# EAGLE design Esp8266_DevBoard (EAGLE 6.5.0)
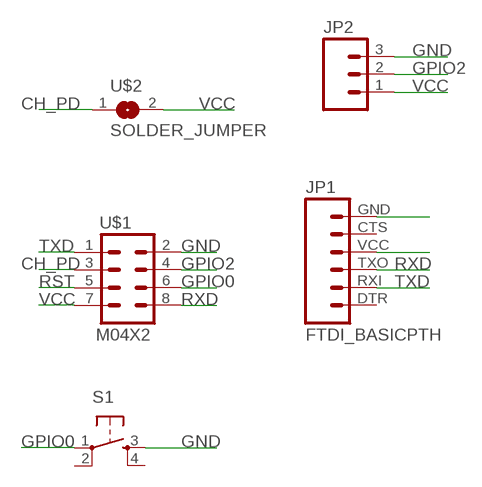
[diagram p0: schematic, sheet 1]

## Parts
JP1  FTDI_BASICPTH  [FTDI_BASIC]
JP2  M03PTH  [1X03]
S1  6MM_SWITCH6MM_SWITCH  [6MM_SWITCH]
U$1  M04X2  [2X4]
U$2  SOLDER_JUMPER  [SJFAB]

## Nets
CH_PD: U$1.3 U$2.1
GND: JP1.GND JP2.3 S1.3(S) U$1.2
GPIO0: S1.1(P) U$1.6
GPIO2: JP2.2 U$1.4
RST: U$1.5
RXD: JP1.TXO U$1.8
TXD: JP1.RXI U$1.1
VCC: JP1.VCC JP2.1 U$1.7 U$2.2
Unconnected: JP1.CTS JP1.DTR S1.2(P1) S1.4(S1)

## Library data of the parts
JP1 = SparkFun-Connectors:FTDI_BASIC: FTDI Basic header with labels
JP2 = SparkFun-Connectors:M03: Header 3 Standard 3-pin 0.1" header. Use with straight break away headers (SKU : PRT-00116), right angle break away headers (PRT-00553), swiss pins (PRT-00743), machine pins (PRT-00117), and female headers (PRT-00115). Molex polarized connector foot print use with SKU : PRT-08232 with associated crimp pins and housings.
S1 = fab:6MM_SWITCH: OMRON SWITCH
U$1 = SparkFun-Connectors:M04X2: .1" header, two rows of four.
U$2 = fab:SOLDER_JUMPER

## Board
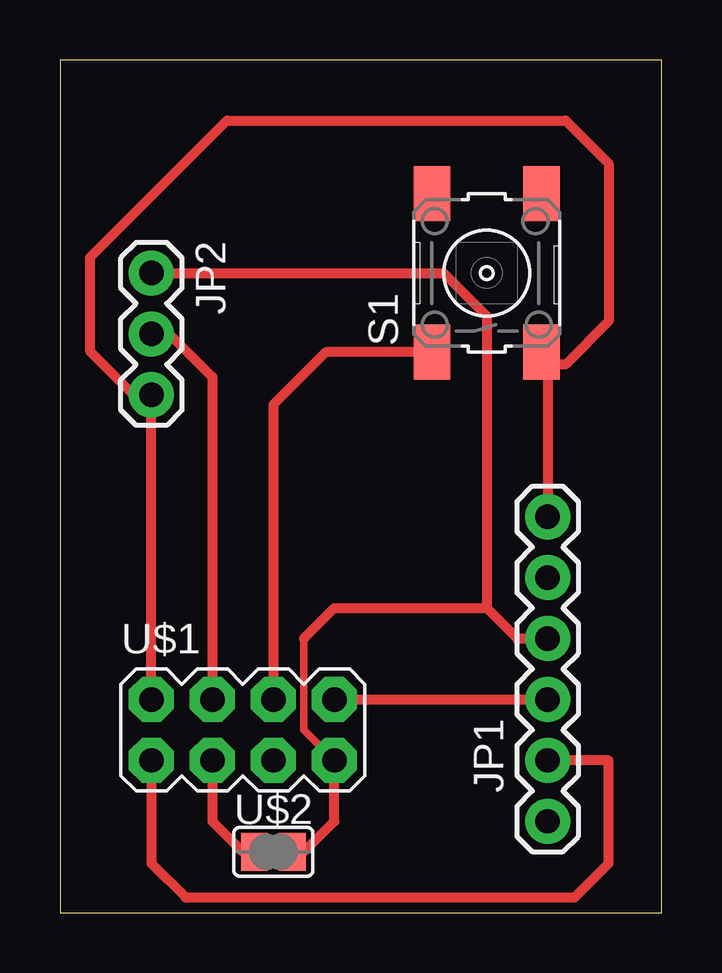
[diagram p1: board, top side]

Size 25.07 x 35.55 mm. Coordinates in mm from the lower left corner, seen from the top.
Outline: 0,0 25.07,0 25.07,35.55 0,35.55 0,0
Copper layers (1*16): Top 0.035mm / dielectric 1.5mm / Bottom 0.035mm
Design rules "default": minimum track width 10mil, minimum drill 24mil, track to track 8mil, track to pad 8mil, pad to pad 8mil, via to via 8mil, smd to smd 8mil, copper to edge 40mil, drill to drill 8mil, minimum pad ring 10mil, minimum via ring 8mil, stop-mask expansion 4mil, vias tented up to drill 0mil, thermal gap 10mil

### Footprints (pad centres in the part's own frame; a part is rotated, then mirrored left to right if it is on the bottom)
FTDI_BASIC = drill 1.016 pad 1.88: CTS 10.16,0; DTR 0,0; GND 12.7,0; RXI 2.54,0; TXO 5.08,0; VCC 7.62,0
1X03 = drill 1.016 pad 1.88: 1 0,0; 2 2.54,0; 3 5.08,0
6MM_SWITCH = smd 2.286 x 1.524: 1 -3.302,2.286; 2 3.302,2.286; 3 -3.302,-2.286; 4 3.302,-2.286
2X4 = drill 1.016 pad 1.88 octagon: 1 -3.81,-1.27; 2 -3.81,1.27; 3 -1.27,-1.27; 4 -1.27,1.27; 5 1.27,-1.27; 6 1.27,1.27; 7 3.81,-1.27; 8 3.81,1.27
SJFAB = smd 1.118 x 1.6: 1 -0.787,0; 2 0.787,0

### Placement (x,y rotation side)
JP1  20.32,3.81 90 top
JP2  3.81,26.67 270 top
S1  17.78,26.67 90 top
U$1  7.62,7.62 0 top
U$2  8.89,2.54 0 top

### Tracks (layer width: path | path; a pad name or v marks a point on that pad's centre or on a via)
CH_PD
  Top 0.406: U$1.3 6.35,3.81 7.62,2.54 U$2.1
GND
  Top 0.406: S1.3 20.32,23.37 20.32,22.86 | 20.32,22.86 JP1.GND | U$1.2 JP2.3 3.07,21.59 1.27,23.39 1.27,27.34 6.95,33.02 21.06,33.02 22.86,31.22 22.86,24.66 21.06,22.86 20.32,22.86
GPIO0
  Top 0.406: S1.1 11.07,23.37 8.89,21.18 U$1.6
GPIO2
  Top 0.406: JP2.2 4.55,24.13 6.35,22.33 U$1.4
RXD
  Top 0.406: U$1.8 JP1.TXO
TXD
  Top 0.406: U$1.1 3.81,2.06 5.23,0.64 21.44,0.64 22.86,2.06 22.86,6.35 JP1.RXI
VCC
  Top 0.305: U$1.7 10.16,7.62 10.16,11.43
  Top 0.406: JP2.1 15.98,26.67 17.78,24.87 17.78,12.7 | 17.78,12.7 19.05,11.43 JP1.VCC | U$2.2 10.16,2.54 11.43,3.81 U$1.7 | 10.16,11.43 11.43,12.7 17.78,12.7